# Altium project LED_Indicator_PCB.PrjPcb
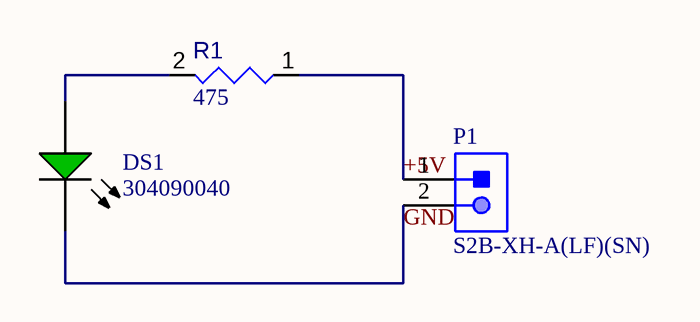
[diagram p0: LED_Indicator.SchDoc]
1 sheet, 3 parts. Net scope: global (net labels, ports and power ports of the same name join across sheets).
Board file: LED_Indicator.PcbDoc

## Sheet LED_Indicator.SchDoc
size A; SheetNumber: 1; SheetTotal: 1

### Parts
DS1  304090040  [LED-2P-2.28-3MM]
P1  S2B-XH-A(LF)(SN)  [JST-S2B-XH-A(LF)(SN)_V]
R1  value 475  [RESA60-630X240]  (hidden comment: MFR-25FBF52-475R)

### Nets
+5V: P1.1 R1.1
GND: DS1.2(K) P1.2
NetDS1_1: DS1.1(A) R1.2

### Library data of the parts
DS1 = CMP-007-00006-2: Green LED, 80 mW, 20 mA, -25 to 85 degC, 2-Pin THD; Manufacturer: Shenzhen CGX; Manufacturer URL: http://szcgx.com/; Package Reference: 304090040; Datasheet Version: Rev. 1.0, 09/2014; RoHS Compliant: Unknown; Case/Package: 304090040; Package Description: 2-Pin Through Hole Device, Dia 3 mm, Pitch 2.28 mm; Datasheet URL: http://datasheet.octopart.com/304090040-Chengguangxing-datasheet-62330655.pdf; Mounting Technology: TH
P1 = CMP-002-00032-2: Male Header, Pitch 2.5 mm, 1 x 2 Position, Height 6.1 mm, Tail Length 3.4 mm, -25 to 85 degC, RoHS, Bulk; Manufacturer: JST; Case/Package: S2B-XH-A(LF)(SN); Package Description: XH Series Disconnectable Crimp Style Connector, Pitch 2.5 mm, 1 x 2 Position, Height 6.1 mm, Tail Length 3.4 mm; Manufacturer URL: http://www.jst.com/home2.html; Datasheet URL: http://www.jst-mfg.com/product/pdf/eng/eXH.pdf; Connector Type: Header; Package Reference: S2B-XH-A(LF)(SN); Mounting Technology: TH; Max Operating Temperature: 85°C; Min Operating Temperature: -25°C; Datasheet Version: May-16; Gender: Male; RoHS Compliant: Unknown
R1 = CMP-009-00056-4: Axial Resistor, 475 Ohm, +/- 1%, 0.25 W, -55 to 155 degC, 2-Pin THD, RoHS, Bulk; Manufacturer: Yageo; Voltage Rating: 250V; Power: 250mW; Case/Package: Axial; Datasheet URL: http://www.yageo.com/documents/recent/Yageo%20LR_MFR_2013.pdf; Tolerance: 1%; RoHS Compliant: True; Mounting Technology: TH; Packaging: Bulk; Package Description: 2-Pin Axial Lead, Dia 2.4 mm, Body Length 6.3 mm; Max Operating Temperature: 155°C; Package Reference: MFR-25; Datasheet Version: Apr-13; Min Operating Temperature: -55°C; Package Quantity: 200; Manufacturer URL: http://www.yageo.com/